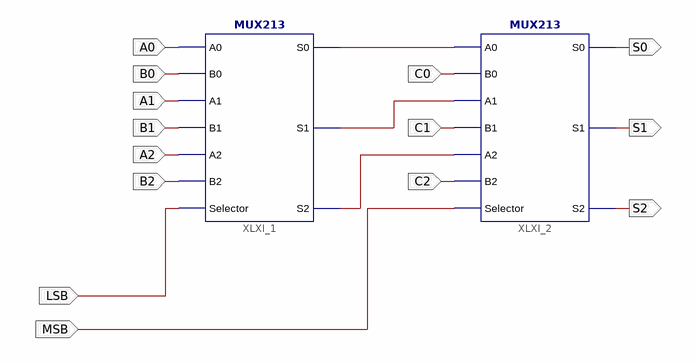
[diagram p0: schematic sheet 1]
// Xilinx ISE schematic MUX313.sch (spartan6) as structural Verilog: 2 symbols, 14 ports
module MUX313 (
  input  LSB,
  input  MSB,
  input  C0,
  input  C1,
  input  C2,
  input  A0,
  input  B0,
  input  A1,
  input  B1,
  input  A2,
  input  B2,
  output S0,
  output S1,
  output S2
);

  wire XLXN_4, XLXN_5, XLXN_6;

  MUX213 XLXI_1 (
    .A0(A0), .B0(B0), .A1(A1), .B1(B1), .A2(A2), .B2(B2), .Selector(LSB), .S0(XLXN_4), .S1(XLXN_5),
    .S2(XLXN_6));
  MUX213 XLXI_2 (
    .A0(XLXN_4), .B0(C0), .A1(XLXN_5), .B1(C1), .A2(XLXN_6), .B2(C2), .Selector(MSB), .S0(S0), .S1(S1),
    .S2(S2));
endmodule
